# EAGLE schematic Ex EEPROM.SOP16 (EAGLE 7.6.0)
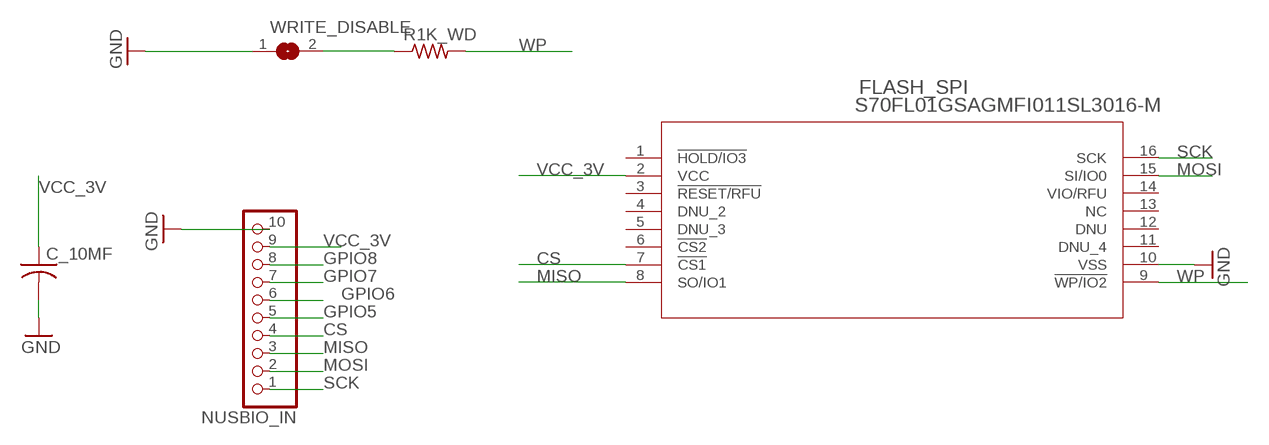
[diagram p0: schematic, sheet 1]

## Parts
C_10MF  C-USC1206  [C1206]
FLASH_SPI  S70FL01GSAGMFI011SL3016-M  [SL3016-M]
NUSBIO_IN  PINHD-1X10  [1X10-BIG]
R1K_WD  R-US_R1206  [R1206]
WRITE_DISABLE  SOLDERJUMPERREFLOW  [SOLDERJUMPER_REFLOW]

## Nets
CS: FLASH_SPI.7(!CS1) NUSBIO_IN.4
GND: C_10MF.2 FLASH_SPI.10(VSS) NUSBIO_IN.10 WRITE_DISABLE.1
GPIO5: NUSBIO_IN.5
GPIO6: NUSBIO_IN.6
GPIO7: NUSBIO_IN.7
GPIO8: NUSBIO_IN.8
MISO: FLASH_SPI.8(SO/IO1) NUSBIO_IN.3
MOSI: FLASH_SPI.15(SI/IO0) NUSBIO_IN.2
N$1: R1K_WD.1 WRITE_DISABLE.2
SCK: FLASH_SPI.16(SCK) NUSBIO_IN.1
VCC_3V: C_10MF.1 FLASH_SPI.2(VCC) NUSBIO_IN.9
WP: FLASH_SPI.9(!WP/IO2) R1K_WD.2
Unconnected: FLASH_SPI.1(!HOLD/IO3) FLASH_SPI.3(!RESET/RFU) FLASH_SPI.4(DNU_2) FLASH_SPI.5(DNU_3) FLASH_SPI.6(!CS2) FLASH_SPI.11(DNU_4) FLASH_SPI.12(DNU) FLASH_SPI.13(NC) FLASH_SPI.14(VIO/RFU)

## Library data of the parts
C_10MF = adafruit:C-US: CAPACITOR, American symbol
FLASH_SPI = MadeInTheUSB_Cypress_Flash_SOIC16:S70FL01GSAGMFI011; MANUFACTURER_PART_NUMBER: S70FL01GSAGMFI011; VENDOR: SPANSION
NUSBIO_IN = adafruit:PINHD-1X10: Pin header 1x10 0.1" spacing With round pins
R1K_WD = adafruit:R-US_: RESISTOR, American symbol
WRITE_DISABLE = microbuilder:SOLDERJUMPER: SMD Solder JUMPER Solder the two pads together to create a connection, or remove the solder to break it. REFLOW - Use this footprint for solder paste and reflow ovens. WAVE - Use this footprint for hand-soldering (larger pads). CLOSED - Has a trace between the two pads to ensure it is closed by default. The trace needs to be cut to disable the jumper, and can be closed again by creating a solder bridge between the two pads.